# EasyEDA schematic FULL WAVE RECTIFIER PCB.json
TITLE: Sheet_1; REV: 1.0; Date: 2023-09-18; Sheet: 1/1; Drawn By: pv8821; Company: Your Company
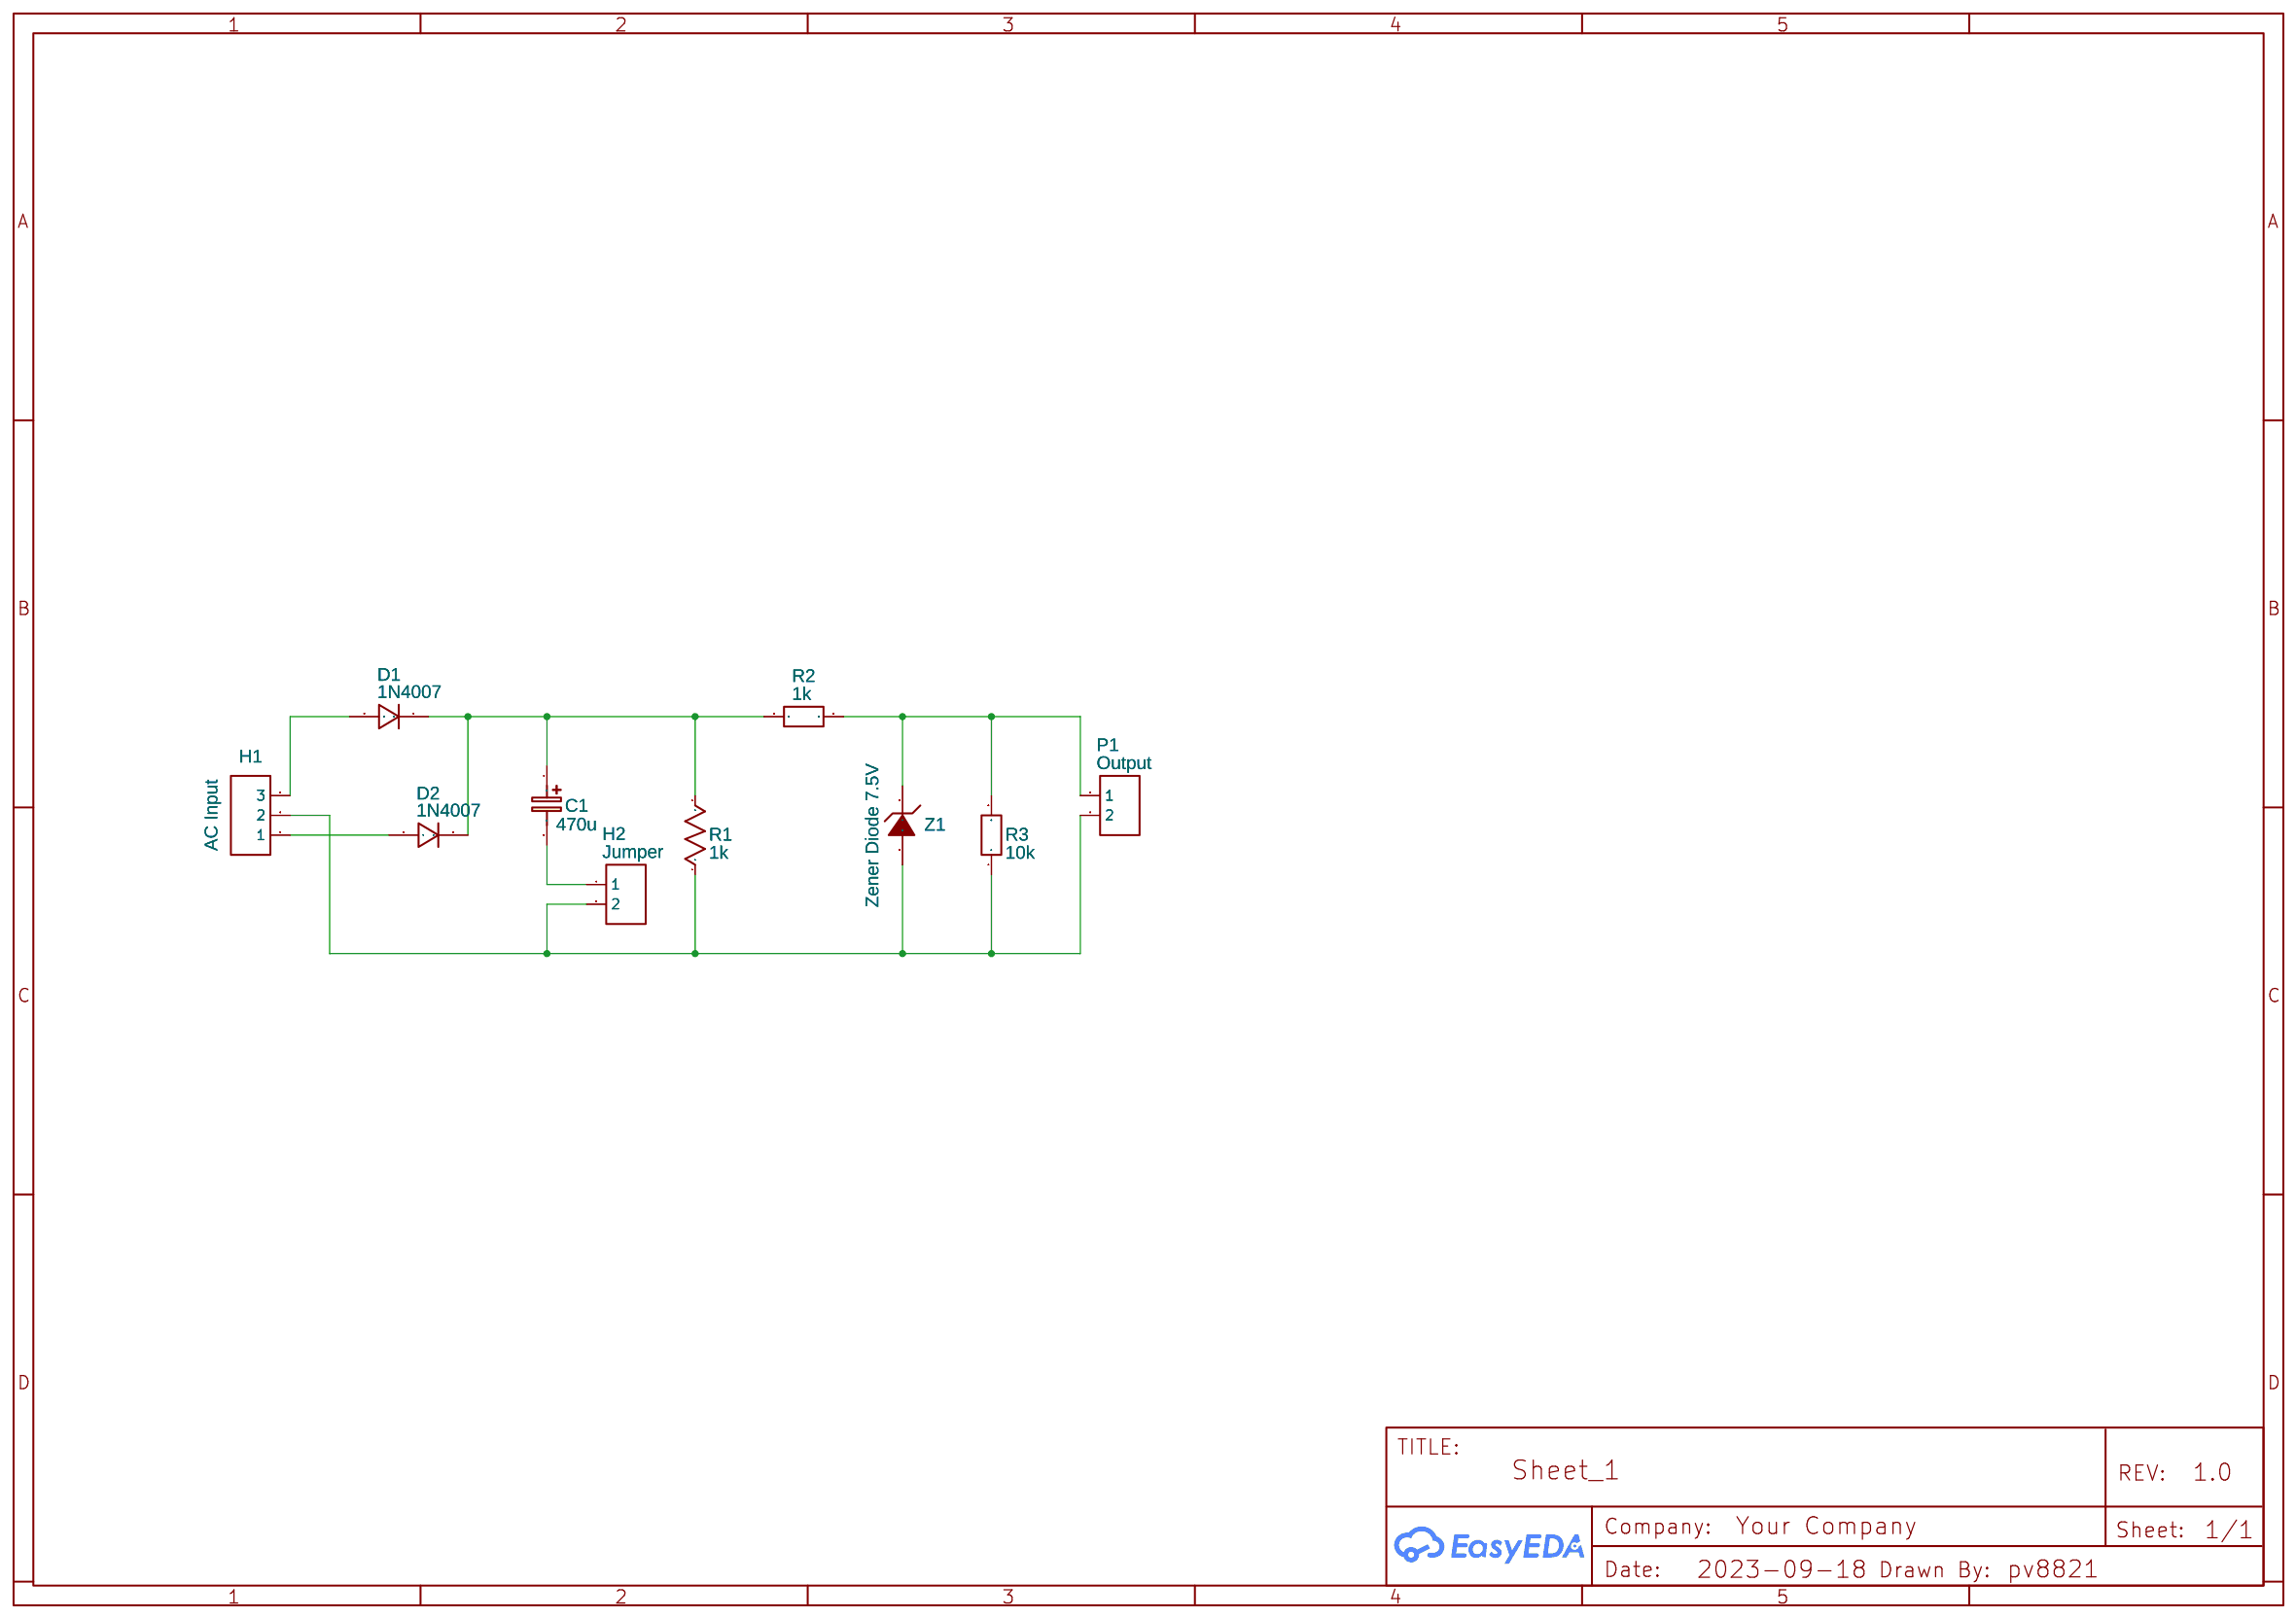
[diagram p0: schematic sheet]

## Parts
C1  470u  [CAP-D5.0×F2.0]
D1  1N4007  [DO-41_BD2.4-L4.7-P8.70-D0.9-RD]
D2  1N4007  [DO-41_BD2.4-L4.7-P8.70-D0.9-RD]
H1  AC Input  [HDR-F-2.54_1X3]
H2  Jumper  [HDR-F-2.54_1X2]
P1  Output  [CONN-TH_2P-P5.00]
R1  1k  [R_AXIAL-0.5]
R2  1k  [R_AXIAL-0.5]
R3  10k  [R_AXIAL-0.5]
Z1  Zener Diode 7.5V  [DO-27_BD3.5-L8.6-P12.60-D1.3-RD]

## Library data of the parts
C1 = CE_TH_D5.0×F2.0_EU: Contributor: LCEDA_Lib
D1 D2 = 1N4007: Supplier: LCSC; Manufacturer: SEMTECH; Supplier Part: C106903; Contributor: LCEDA_Lib
H1 = HDR-F-2.54_1x3: Supplier Part: C146690; Supplier: LCSC; Contributor: LCEDA_Lib
H2 = HDR-F-2.54_1x2: Supplier Part: C49661; Supplier: LCSC; Contributor: LCEDA_Lib
P1 = CONN-TH_2P-P5.00: Supplier: LCSC; Contributor: LCEDA_Lib
R1 = R_AXIAL-0.5_US: Contributor: LCEDA_Lib
R2 R3 = R_AXIAL-0.5_EU: Contributor: LCEDA_Lib
Z1 = 1N5349BRLG: Supplier: LCSC; Manufacturer: onsemi(安森美); Supplier Part: C9078; JLCPCB Part Class: Extended Part; link: https://lcsc.com/eda_search?q=C9078&%26type=1&ref=editor

## Nets
Net-(C1-1): C1.1 D1.1 D2.1 R1.2 R2.1
Net-(C1-2): C1.2 H2.1
Net-(D1-2): D1.2 H1.3
Net-(D2-2): D2.2 H1.1
Net-(H1-2): H1.2 H2.2 P1.2 R1.1 R3.1 Z1.1(C)
Net-(P1-1): P1.1 R2.2 R3.2 Z1.2(A)
